# EAGLE schematic display (EAGLE 7.7.0)
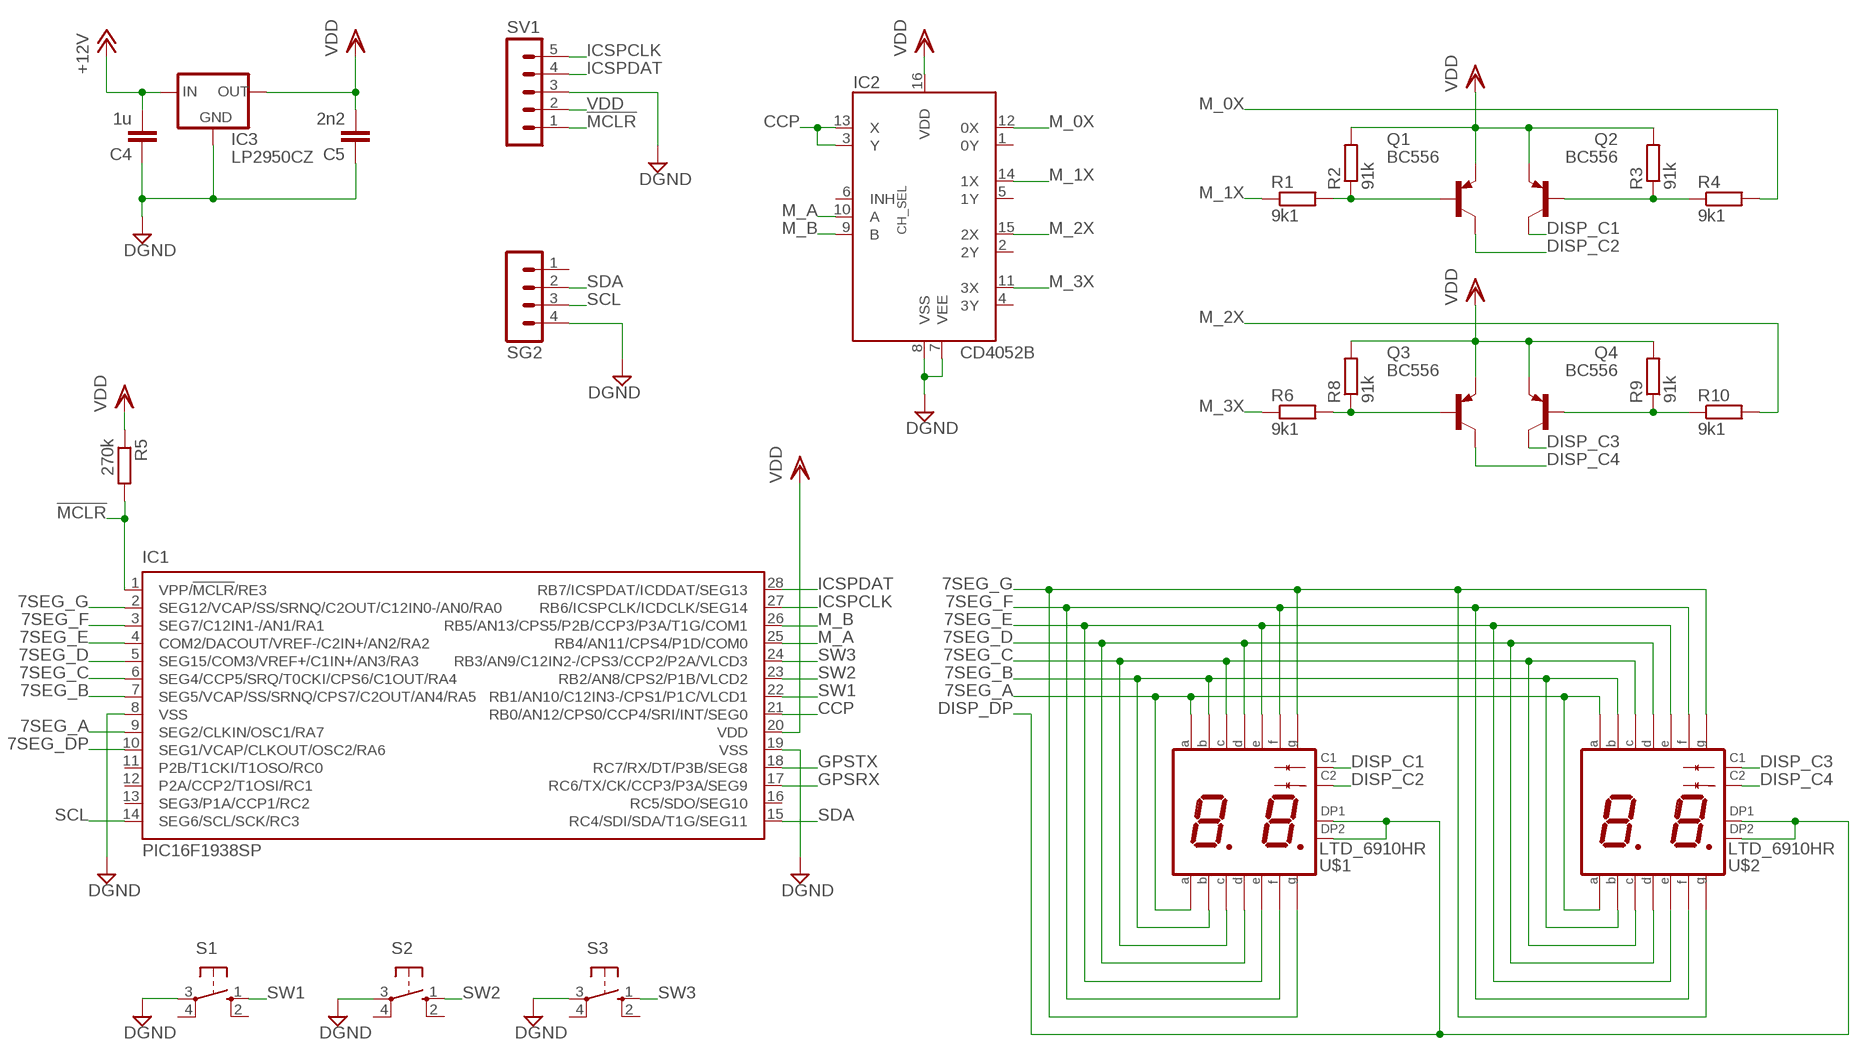
[diagram p0: schematic, sheet 1]

## Parts
C4  1u  C5/2.5  [C5B2.5]
C5  2n2  C5/2.5  [C5B2.5]
IC1  PIC16F1938SP  [DIL28-3]
IC2  CD4052B  [DIL16]
IC3  LP2950CZ  LP2950CZ-5.0  [TO92]
Q1  BC556  [TO92-EBC]
Q2  BC556  [TO92-EBC]
Q3  BC556  [TO92-EBC]
Q4  BC556  [TO92-EBC]
R1  9k1  R-EU_0204/5  [0204/5]
R2  91k  R-EU_0204/5  [0204/5]
R3  91k  R-EU_0204/5  [0204/5]
R4  9k1  R-EU_0204/5  [0204/5]
R5  270k  R-EU_M1206  [M1206]
R6  9k1  R-EU_0204/5  [0204/5]
R8  91k  R-EU_0204/5  [0204/5]
R9  91k  R-EU_0204/5  [0204/5]
R10  9k1  R-EU_0204/5  [0204/5]
S1  10-XX  [B3F-10XX]
S2  10-XX  [B3F-10XX]
S3  10-XX  [B3F-10XX]
SG2  MA04-1  [MA04-1]
SV1  MA05-1  [MA05-1]
U$1  LTD_6910HR  [7-SEG-LED-DUAL]
U$2  LTD_6910HR  [7-SEG-LED-DUAL]

## Nets
7SEG_A: IC1.9(SEG2/CLKIN/OSC1/RA7) U$1.P$11(A2) U$1.P$16(A1) U$2.P$11(A2) U$2.P$16(A1)
7SEG_B: IC1.7(SEG5/VCAP/SS/SRNQ/CPS7/C2OUT/AN4/RA5) U$1.P$10(B2) U$1.P$15(B1) U$2.P$10(B2) U$2.P$15(B1)
7SEG_C: IC1.6(SEG4/CCP5/SRQ/T0CKI/CPS6/C1OUT/RA4) U$1.P$3(C1) U$1.P$8(C2) U$2.P$3(C1) U$2.P$8(C2)
7SEG_D: IC1.5(SEG15/COM3/VREF+/C1IN+/AN3/RA3) U$1.P$2(D1) U$1.P$6(D2) U$2.P$2(D1) U$2.P$6(D2)
7SEG_DP: IC1.10(SEG1/VCAP/CLKOUT/OSC2/RA6)
7SEG_E: IC1.4(COM2/DACOUT/VREF-/C2IN+/AN2/RA2) U$1.P$1(E1) U$1.P$5(E2) U$2.P$1(E1) U$2.P$5(E2)
7SEG_F: IC1.3(SEG7/C12IN1-/AN1/RA1) U$1.P$12(F2) U$1.P$18(F1) U$2.P$12(F2) U$2.P$18(F1)
7SEG_G: IC1.2(SEG12/VCAP/SS/SRNQ/C2OUT/C12IN0-/AN0/RA0) U$1.P$7(G2) U$1.P$17(G1) U$2.P$7(G2) U$2.P$17(G1)
!MCLR: IC1.1(VPP/!MCLR!/RE3) R5.2 SV1.1
+12V: C4.2 IC3.3(IN)
CCP: IC1.21(RB0/AN12/CPS0/CCP4/SRI/INT/SEG0) IC2.3(Y) IC2.13(X)
DGND: C4.1 C5.1 IC1.8(VSS) IC1.19(VSS) IC2.7(VEE) IC2.8(VSS) IC3.2(GND) S1.3(P) S2.3(P) S3.3(P) SG2.4 SV1.3
DISP_C1: Q2.C U$1.P$14(C)
DISP_C2: Q1.C U$1.P$13(C)
DISP_C3: Q4.C U$2.P$14(C)
DISP_C4: Q3.C U$2.P$13(C)
DISP_DP: U$1.P$4(DP) U$1.P$9(DP) U$2.P$4(DP) U$2.P$9(DP)
GPSRX: IC1.17(RC6/TX/CK/CCP3/P3A/SEG9)
GPSTX: IC1.18(RC7/RX/DT/P3B/SEG8)
ICSPCLK: IC1.27(RB6/ICSPCLK/ICDCLK/SEG14) SV1.5
ICSPDAT: IC1.28(RB7/ICSPDAT/ICDDAT/SEG13) SV1.4
M_0X: IC2.12(0X) R4.2
M_1X: IC2.14(1X) R1.1
M_2X: IC2.15(2X) R10.2
M_3X: IC2.11(3X) R6.1
M_A: IC1.25(RB4/AN11/CPS4/P1D/COM0) IC2.10(A)
M_B: IC1.26(RB5/AN13/CPS5/P2B/CCP3/P3A/T1G/COM1) IC2.9(B)
N$3: Q2.B R3.1 R4.1
N$4: Q3.B R6.2 R8.1
N$7: Q4.B R9.1 R10.1
N$15: Q1.B R1.2 R2.1
SCL: IC1.14(SEG6/SCL/SCK/RC3) SG2.3
SDA: IC1.15(RC4/SDI/SDA/T1G/SEG11) SG2.2
SW1: IC1.22(RB1/AN10/C12IN3-/CPS1/P1C/VLCD1) S1.1(S)
SW2: IC1.23(RB2/AN8/CPS2/P1B/VLCD2) S2.1(S)
SW3: IC1.24(RB3/AN9/C12IN2-/CPS3/CCP2/P2A/VLCD3) S3.1(S)
VDD [power]: C5.2 IC1.20(VDD) IC2.16(VDD) IC3.1(OUT) Q1.E Q2.E Q3.E Q4.E R2.2 R3.2 R5.1 R8.2 R9.2 SV1.2
Unconnected: IC1.11(P2B/T1CKI/T1OSO/RC0) IC1.12(P2A/CCP2/T1OSI/RC1) IC1.13(SEG3/P1A/CCP1/RC2) IC1.16(RC5/SDO/SEG10) IC2.1(0Y) IC2.2(2Y) IC2.4(3Y) IC2.5(1Y) IC2.6(INH) S1.2(S1) S1.4(P1) S2.2(S1) S2.4(P1) S3.2(S1) S3.4(P1) SG2.1

## Library data of the parts
C4 C5 = capacitor-wima:C: CAPACITOR naming: grid - package width
IC1 = microchip:PIC16F19*: Flash-Based, 8-Bit CMOS Microcontrollers wtih LCD Driver and nanoWatt XLP Technology Auto generated by make-symbol-device-package-bsdl.ulp Rev. 33 Source: http://ww1.microchip.com/downloads/en/DeviceDoc/41364D.pdf; MPN: PIC16F1938-I/SP; OC_FARNELL: 1755829; OC_NEWARK: 08R1949
IC2 = julio:CD4052B: CD4053B CMOS Single 8-Channel Analog Multiplexer/Demultiplexer With Logic-Level Conversion
IC3 = v-reg:LP2950?*: Source: http://cache.national.com/ds/LP/LP2950.pdf
Q1-Q4 = transistor-pnp:BC556*: PNP Transistror
R1-R6 R8-R10 = resistor:R-EU_: RESISTOR, European symbol
S1-S3 = switch-omron:10-XX: OMRON SWITCH; MPN: B3F-1000; OC_FARNELL: 176432; OC_NEWARK: 36M3542
SG2 = con-lstb:MA04-1: PIN HEADER; OC_FARNELL: unknown; OC_NEWARK: unknown
SV1 = con-lstb:MA05-1: PIN HEADER; OC_FARNELL: unknown; OC_NEWARK: unknown
U$1 U$2 = julio:LTD_6910HR: LITE-ON 7-SEGMENT DISPLAYS The LTD - 6910HR is a 0. 56 inch ( 14.22 mm) height dual digit seven - segment display. This device utilizes high efficiency red LED chips, which are made from GaAsP on a transparent GaP substrat e, and has a red face and red segments.

## Net classes
1 power: width 0.8 mm